# EAGLE design cpuboard_pic32mx_rev01 (EAGLE 6.4)
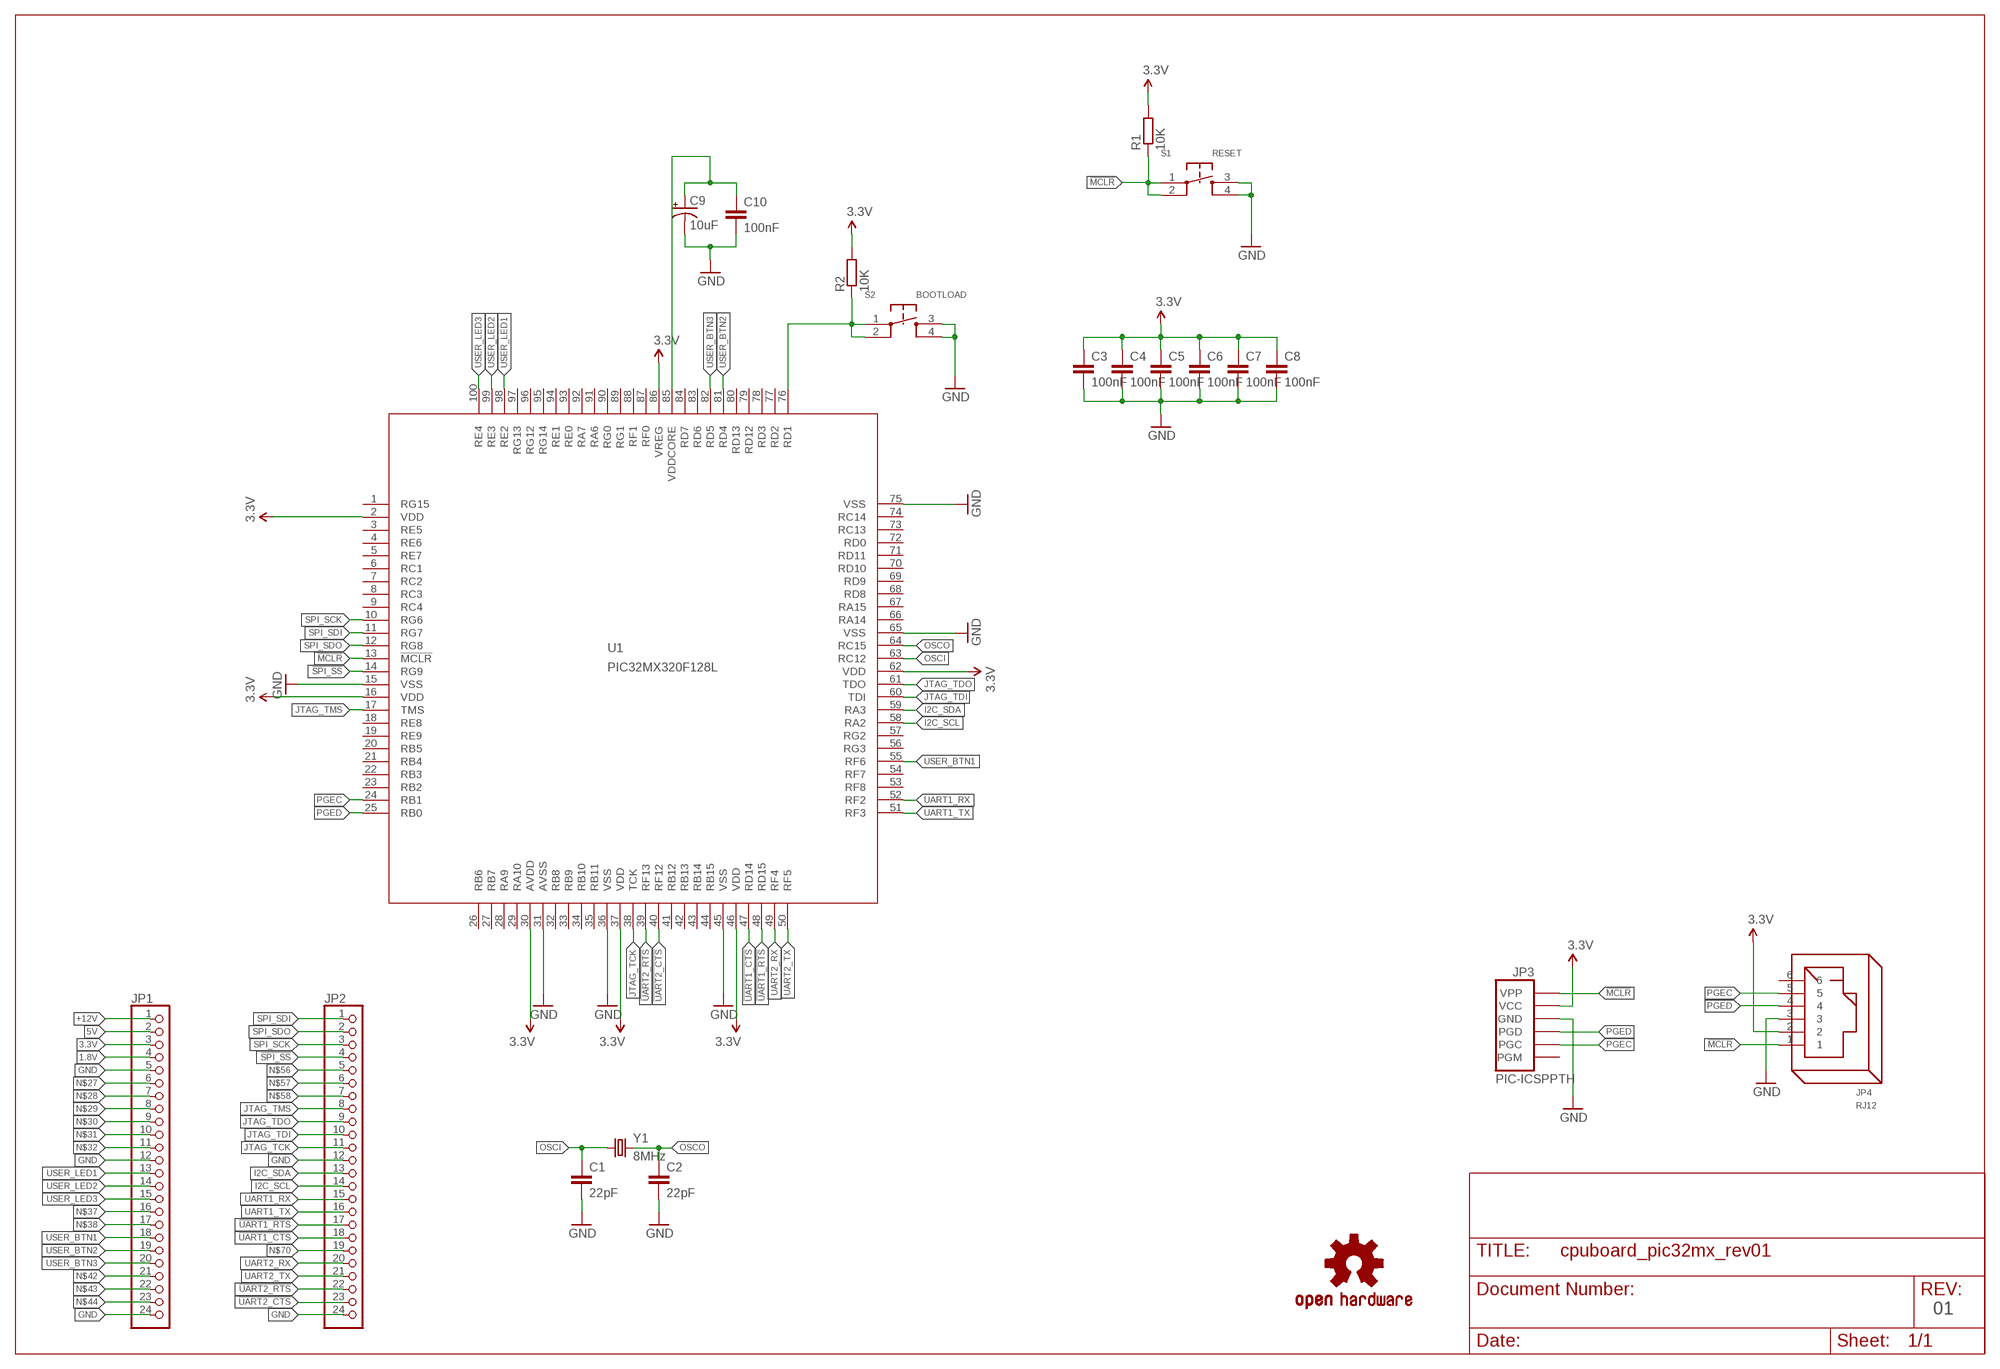
[diagram p0: schematic, sheet 1]

## Parts
C1  22pF  C-EUC0805K  [C0805K]
C2  22pF  C-EUC0805K  [C0805K]
C3  100nF  C-EUC0805K  [C0805K]
C4  100nF  C-EUC0805K  [C0805K]
C5  100nF  C-EUC0805K  [C0805K]
C6  100nF  C-EUC0805K  [C0805K]
C7  100nF  C-EUC0805K  [C0805K]
C8  100nF  C-EUC0805K  [C0805K]
C9  10uF  CAP_POLD  [PANASONIC_D]
C10  100nF  C-EUC0805K  [C0805K]
JP1  PINHD-1X24  [1X24]
JP2  PINHD-1X24  [1X24]
JP3  PIC-ICSPPTH  [MOLEX-1X6]
JP4  RJ12  [RJ12]
R1  10K  R-EU_R0805  [R0805]
R2  10K  R-EU_R0805  [R0805]
S1  RESET  SWITCH_TH  [SWITCH_TROUGHHOLE]
S2  BOOTLOAD  SWITCH_TH  [SWITCH_TROUGHHOLE]
U1  PIC32MX320F128L  [SQFP-S-12X12-100]
U$1  OSHW-LOGOS  [OSHW-LOGO-S]
Y1  8MHz  CRYSTALSMD  [HC49UP]

## Nets
1.8V: JP1.4
3.3V: C3.1 C4.1 C5.1 C6.1 C7.1 C8.1 JP1.3 JP3.5(VCC) JP4.2 R1.2 R2.2 U1.2(VDD) U1.16(VDD) U1.30(AVDD) U1.37(VDD) U1.46(VDD) U1.62(VDD) U1.86(VREG)
5V: JP1.2
!MCLR: JP3.6(VPP) JP4.1 R1.1 S1.1 S1.2 U1.13(!MCLR)
!SPI_SS: JP2.4 U1.14(RG9)
!UART1_CTS: JP2.18 U1.47(RD14)
!UART1_RTS: JP2.17 U1.48(RD15)
!UART2_CTS: JP2.23 U1.40(RF12)
!UART2_RTS: JP2.22 U1.39(RF13)
+12V: JP1.1
GND: C1.2 C2.2 C3.2 C4.2 C5.2 C6.2 C7.2 C8.2 C9.- C10.2 JP1.5 JP1.12 JP1.24 JP2.12 JP2.24 JP3.4(GND) JP4.3 S1.3 S1.4 S2.3 S2.4 U1.15(VSS) U1.31(AVSS) U1.36(VSS) U1.45(VSS) U1.65(VSS) U1.75(VSS)
I2C_SCL: JP2.14 U1.58(RA2)
I2C_SDA: JP2.13 U1.59(RA3)
JTAG_TCK: JP2.11 U1.38(TCK)
JTAG_TDI: JP2.10 U1.60(TDI)
JTAG_TDO: JP2.9 U1.61(TDO)
JTAG_TMS: JP2.8 U1.17(TMS)
N$2: C9.+ C10.1 U1.85(VDDCORE)
N$12: R2.1 S2.1 S2.2 U1.76(RD1)
N$27: JP1.6
N$28: JP1.7
N$29: JP1.8
N$30: JP1.9
N$31: JP1.10
N$32: JP1.11
N$37: JP1.16
N$38: JP1.17
N$42: JP1.21
N$43: JP1.22
N$44: JP1.23
N$56: JP2.5
N$57: JP2.6
N$58: JP2.7
N$70: JP2.19
OSCI: C1.1 U1.63(RC12) Y1.1
OSCO: C2.1 U1.64(RC15) Y1.2
PGEC: JP3.2(PGC) JP4.5 U1.24(RB1)
PGED: JP3.3(PGD) JP4.4 U1.25(RB0)
SPI_SCK: JP2.3 U1.10(RG6)
SPI_SDI: JP2.1 U1.11(RG7)
SPI_SDO: JP2.2 U1.12(RG8)
UART1_RX: JP2.15 U1.52(RF2)
UART1_TX: JP2.16 U1.51(RF3)
UART2_RX: JP2.20 U1.49(RF4)
UART2_TX: JP2.21 U1.50(RF5)
USER_BTN1: JP1.18 U1.55(RF6)
USER_BTN2: JP1.19 U1.81(RD4)
USER_BTN3: JP1.20 U1.82(RD5)
USER_LED1: JP1.13 U1.98(RE2)
USER_LED2: JP1.14 U1.99(RE3)
USER_LED3: JP1.15 U1.100(RE4)
Unconnected: JP3.1(PGM) JP4.6 U1.1(RG15) U1.3(RE5) U1.4(RE6) U1.5(RE7) U1.6(RC1) U1.7(RC2) U1.8(RC3) U1.9(RC4) U1.18(RE8) U1.19(RE9) U1.20(RB5) U1.21(RB4) U1.22(RB3) U1.23(RB2) U1.26(RB6) U1.27(RB7) U1.28(RA9) U1.29(RA10) U1.32(RB8) U1.33(RB9) U1.34(RB10) U1.35(RB11) U1.41(RB12) U1.42(RB13) U1.43(RB14) U1.44(RB15) U1.53(RF8) U1.54(RF7) U1.56(RG3) U1.57(RG2) U1.66(RA14) U1.67(RA15) U1.68(RD8) U1.69(RD9) U1.70(RD10) U1.71(RD11) U1.72(RD0) U1.73(RC13) U1.74(RC14) U1.77(RD2) U1.78(RD3) U1.79(RD12) U1.80(RD13) U1.83(RD6) U1.84(RD7) U1.87(RF0) U1.88(RF1) U1.89(RG1) U1.90(RG0) U1.91(RA6) U1.92(RA7) U1.93(RE0) U1.94(RE1) U1.95(RG14) U1.96(RG12) U1.97(RG13)

## Notes on the sheet
- 01

## Library data of the parts
C1-C8 C10 = rcl:C-EU: CAPACITOR, European symbol
C9 = SparkFun:CAP_POL: Capacitor Polarized These are standard SMD and PTH capacitors. Normally 10uF, 47uF, and 100uF in electrolytic and tantalum varieties. Always verify the external diameter of the through hole cap, it varies with capacity, voltage, and manufacturer. The EIA devices should be standard.
JP1 JP2 = pinhead:PINHD-1X24: PIN HEADER
JP3 = SparkFun-Connectors:PIC-ICSP: ISCP Programming connector for UAV, UBW Kit, etc.
JP4 = con-rj:RJ12: RJ12, RJ14 and RJ25 RJ12, RJ14 and RJ25 jacks side mounted http://www.tycoelectronics.com
R1 R2 = rcl:R-EU_: RESISTOR, European symbol
S1 S2 = funkfinger:SWITCH_TH
U1 = microchip:PIC32MX320F128L: PIC32MX320F128L edit this description Auto generated by make-symbol-device-package-bsdl.ulp Rev. 25 Source: PIC32MX320F128L.bsdl; MPN: PIC32MX320F128L-80I/PT; OC_FARNELL: 1523321; OC_NEWARK: 77M3149
U$1 = SparkFun-Aesthetics:OSHW-LOGO: Open Source Hardware Logo This logo indicates the piece of hardware it is found on incorporates a OSHW license and/or adheres to the definition of open source hardware found here: http://freedomdefined.org/OSHW
Y1 = SparkFun-FreqCtrl:CRYSTAL: Various standard crystals. Proven footprints. Spark Fun Electronics SKU : COM-00534

## Board
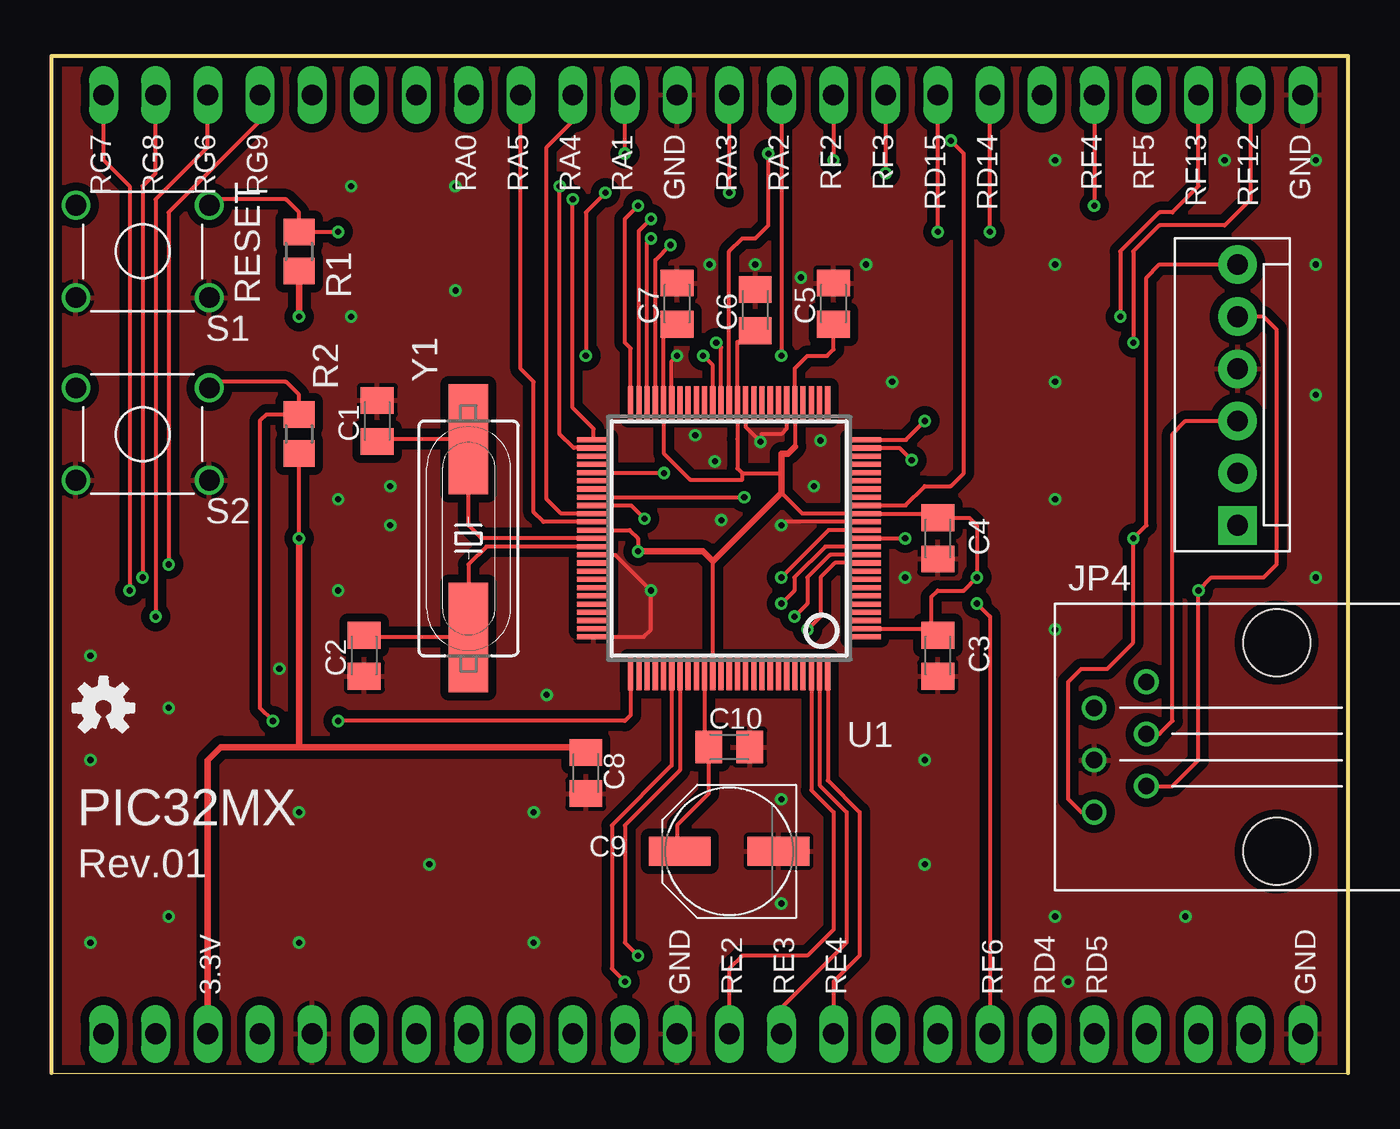
[diagram p1: board, top side]
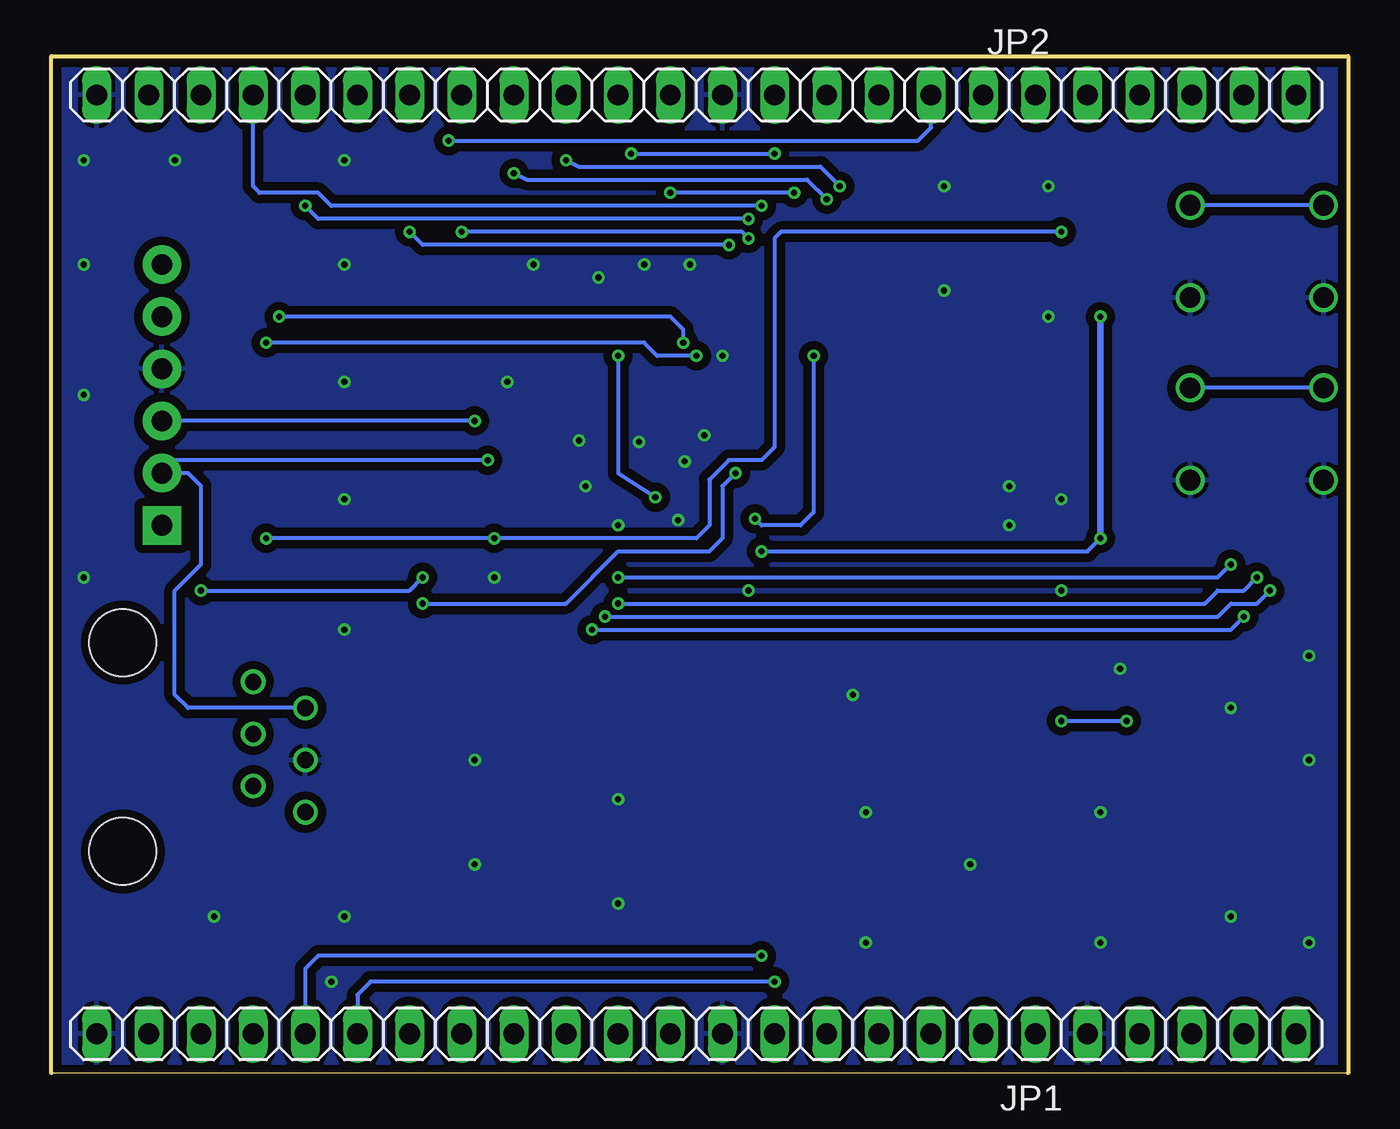
[diagram p2: board, bottom side, seen from below]

Size 63.17 x 49.52 mm. Coordinates in mm from the lower left corner, seen from the top.
Outline: 0,0 63.17,0 63.17,49.52 0,49.52 0,0
Copper layers (1*16): Top 0.035mm / dielectric 1.5mm / Bottom 0.035mm
Design rules "PCB-POOL Standard": minimum track width 0.15mm, minimum drill 0.3mm, track to track 0.15mm, track to pad 0.15mm, pad to pad 0.15mm, via to via 0.15mm, smd to smd 0.15mm, copper to edge 0.3mm, drill to drill 0.2mm, minimum pad ring 0.2mm, minimum via ring 0.15mm, stop-mask expansion 0.075mm, vias tented up to drill 0mil, thermal gap 0.2mm

### Footprints (pad centres in the part's own frame; a part is rotated, then mirrored left to right if it is on the bottom)
C0805K = smd 1.3 x 1.6: 1 -1,0; 2 1,0
PANASONIC_D = smd 3 x 1.4: + 2.4,0; - -2.4,0
1X24 = drill 1.016 long: 1 -29.21,0; 2 -26.67,0; 3 -24.13,0; 4 -21.59,0; 5 -19.05,0; 6 -16.51,0; 7 -13.97,0; 8 -11.43,0; 9 -8.89,0; 10 -6.35,0; 11 -3.81,0; 12 -1.27,0; 13 1.27,0; 14 3.81,0; 15 6.35,0; 16 8.89,0; 17 11.43,0; 18 13.97,0; 19 16.51,0; 20 19.05,0; 21 21.59,0; 22 24.13,0; 23 26.67,0; 24 29.21,0
MOLEX-1X6 = drill 1.016 pad 1.88 square: 1 0,0 | drill 1.016 pad 1.88: 2 2.54,0; 3 5.08,0; 4 7.62,0; 5 10.16,0; 6 12.7,0
RJ12 = drill 0.8: 1 -8.89,-3.175; 2 -6.35,-1.905; 3 -8.89,-0.635; 4 -6.35,0.635; 5 -8.89,1.905; 6 -6.35,3.175 | hole 3.25: 0,-5.08; 0,5.08
R0805 = smd 1.3 x 1.5: 1 -0.95,0; 2 0.95,0
SWITCH_TROUGHHOLE = drill 1: 1 -3.25,2.25; 2 3.25,2.25; 3 -3.25,-2.25; 4 3.25,-2.25
SQFP-S-12X12-100 = smd 0.25 x 1.6: 1 -4.8,-6.6; 2 -4.4,-6.6; 3 -4,-6.6; 4 -3.6,-6.6; 5 -3.2,-6.6; 6 -2.8,-6.6; 7 -2.4,-6.6; 8 -2,-6.6; 9 -1.6,-6.6; 10 -1.2,-6.6; 11 -0.8,-6.6; 12 -0.4,-6.6; 13 0,-6.6; 14 0.4,-6.6; 15 0.8,-6.6; 16 1.2,-6.6; 17 1.6,-6.6; 18 2,-6.6; 19 2.4,-6.6; 20 2.8,-6.6; 21 3.2,-6.6; 22 3.6,-6.6; 23 4,-6.6; 24 4.4,-6.6; 25 4.8,-6.6; 51 4.8,6.6; 52 4.4,6.6; 53 4,6.6; 54 3.6,6.6; 55 3.2,6.6; 56 2.8,6.6; 57 2.4,6.6; 58 2,6.6; 59 1.6,6.6; 60 1.2,6.6; 61 0.8,6.6; 62 0.4,6.6; 63 0,6.6; 64 -0.4,6.6; 65 -0.8,6.6; 66 -1.2,6.6; 67 -1.6,6.6; 68 -2,6.6; 69 -2.4,6.6; 70 -2.8,6.6; 71 -3.2,6.6; 72 -3.6,6.6; 73 -4,6.6; 74 -4.4,6.6; 75 -4.8,6.6 | smd 1.6 x 0.25: 26 6.6,-4.8; 27 6.6,-4.4; 28 6.6,-4; 29 6.6,-3.6; 30 6.6,-3.2; 31 6.6,-2.8; 32 6.6,-2.4; 33 6.6,-2; 34 6.6,-1.6; 35 6.6,-1.2; 36 6.6,-0.8; 37 6.6,-0.4; 38 6.6,0; 39 6.6,0.4; 40 6.6,0.8; 41 6.6,1.2; 42 6.6,1.6; 43 6.6,2; 44 6.6,2.4; 45 6.6,2.8; 46 6.6,3.2; 47 6.6,3.6; 48 6.6,4; 49 6.6,4.4; 50 6.6,4.8; 76 -6.6,4.8; 77 -6.6,4.4; 78 -6.6,4; 79 -6.6,3.6; 80 -6.6,3.2; 81 -6.6,2.8; 82 -6.6,2.4; 83 -6.6,2; 84 -6.6,1.6; 85 -6.6,1.2; 86 -6.6,0.8; 87 -6.6,0.4; 88 -6.6,0; 89 -6.6,-0.4; 90 -6.6,-0.8; 91 -6.6,-1.2; 92 -6.6,-1.6; 93 -6.6,-2; 94 -6.6,-2.4; 95 -6.6,-2.8; 96 -6.6,-3.2; 97 -6.6,-3.6; 98 -6.6,-4; 99 -6.6,-4.4; 100 -6.6,-4.8
HC49UP = smd 5.334 x 1.93: 1 -4.826,0; 2 4.826,0

### Placement (x,y rotation side)
C1  15.88,31.75 90 top
C2  15.24,20.32 270 top
C3  43.18,20.32 270 top
C4  43.18,26.04 270 top
C5  38.1,37.47 90 top
C6  34.29,37.15 90 top
C7  30.48,37.47 90 top
C8  26.04,14.61 270 top
C9  33.02,10.79 180 top
C10  33.02,15.88 0 top
JP1  31.75,1.91 180 bottom
JP2  31.75,47.62 180 bottom
JP3  57.79,26.67 90 top
JP4  59.69,15.88 0 top
R1  12.06,40.01 270 top
R2  12.06,31.11 270 top
S1  4.45,40.01 0 top
S2  4.45,31.11 0 top
U1  33.02,26.04 90 top
U$1  2.54,17.78 0 top
Y1  20.32,26.04 270 top

### Tracks (layer width: path | path; a pad name or v marks a point on that pad's centre or on a via)
3.3V  (via drill 0.3)
  Top 0.203: C5.1 38.1,35.24 37.78,34.93 36.83,34.93 36.22,34.32 U1.30 36.22,30.5 | U1.37 33.42,35.59 C6.1 | C7.1 29.82,35.8 U1.46 29.82,30.19 31.11,28.89 33.66,28.89 33.66,29.21 | U1.2 42.87,21.63 | 42.87,21.63 C3.1 | JP4.2 54.61,13.97 55.88,15.24 v55.88,23.49 56.52,24.13 59.05,24.13 59.69,24.76 59.69,36.2 59.05,36.83 JP3.5 | U1.37 33.42,29.44 33.66,29.21 | U1.62 28.18,26.43 28.57,26.04 v28.57,25.4 | v12.06,26.04 R2.2 | 35.56,28.26 36.58,27.23 U1.16 42.98,27.23 C4.1 44.72,27.04 45.09,26.67 v45.09,24.13 44.45,23.49 43.18,23.49 42.87,23.18 42.87,21.63 | U1.86 32.22,24.93 | 33.66,29.21 35.56,29.21 | U1.37 33.42,30.88
  Top 0.305: 36.22,30.5 35.88,30.16 35.56,30.16 35.56,29.21 35.56,28.26 32.55,25.25 32.22,24.93 31.75,25.4 v28.57,25.4 | 12.06,15.88 8.26,15.88 7.62,15.24 JP1.3 | 12.06,15.88 25.77,15.88 C8.1 | v12.06,26.04 12.06,15.88 | R1.2 v12.06,36.83
  Bottom 0.203: v28.57,25.4 12.7,25.4 v12.06,26.04 | v55.88,23.49 45.72,23.49 v45.09,24.13
  Bottom 0.305: v12.06,36.83 v12.06,26.04
!MCLR  (via drill 0.3)
  Top 0.203: U1.13 v41.59,26.04 | JP3.6 53.98,39.37 53.34,38.73 53.34,26.67 v52.71,26.04 52.71,20.95 51.44,19.68 50.17,19.68 49.53,19.05 49.53,13.34 50.17,12.7 JP4.1 | S1.2 7.98,42.55 11.43,42.55 12.06,41.91 R1.1 v13.97,40.96
  Bottom 0.203: v52.71,26.04 v41.59,26.04 31.75,26.04 31.11,26.67 31.11,28.89 30.16,29.84 28.57,29.84 27.94,30.48 27.94,40.64 27.62,40.96 v13.97,40.96 | S1.1 S1.2
!SPI_SS  (via drill 0.3)
  Top 0.203: v5.71,24.76 5.71,41.91 10.16,46.36 JP2.4 | U1.14 37.87,26.43 v35.56,24.13
  Bottom 0.203: v35.56,24.13 6.35,24.13 v5.71,24.76
!UART1_CTS  (via drill 0.3)
  Top 0.203: U1.47 29.42,39.58 v30.16,40.32 | v45.72,40.96 JP2.18
  Bottom 0.203: v30.16,40.32 45.09,40.32 v45.72,40.96
!UART1_RTS  (via drill 0.3)
  Top 0.203: U1.48 29.02,40.45 v29.21,40.64 | v43.18,40.96 JP2.17
  Bottom 0.203: v29.21,40.64 29.53,40.96 v43.18,40.96
!UART2_CTS  (via drill 0.3)
  Top 0.203: v52.71,35.56 52.71,40.01 53.98,41.27 57.15,41.27 58.42,42.55 JP2.23 | U1.40 32.22,34.46 v31.75,34.93
  Bottom 0.203: v31.75,34.93 33.66,34.93 34.29,35.56 v52.71,35.56
!UART2_RTS  (via drill 0.3)
  Top 0.203: v52.07,36.83 52.07,40.01 53.98,41.91 54.61,41.91 55.88,43.18 JP2.22 | U1.39 32.62,35.33 v32.38,35.56
  Bottom 0.203: v32.38,35.56 32.38,36.2 33.02,36.83 v52.07,36.83
GND  (via drill 0.3)
  Top 0.203: U1.65 27.47,25.23 v29.21,23.49 29.21,21.59 28.86,21.23 U1.75 | U1.45 30.22,34.66 v30.48,34.93 | U1.15 35.73,26.83 v35.56,26.67 | U1.36 33.82,31.46 v34.54,30.73 34.61,31.11 35.56,31.11 35.82,31.37 U1.31
  other vias: 48.9,27.94 48.9,33.66 48.9,39.37 48.9,44.45 57.15,44.45 61.6,44.45 61.6,33.02 61.6,39.37 61.6,24.13 55.25,7.62 48.9,7.62 48.9,21.59 42.55,15.24 42.55,10.16 23.5,6.35 12.06,6.35 12.06,12.7 23.5,12.7 18.41,10.16 1.91,20.32 1.91,15.24 1.91,6.35 5.71,17.78 5.71,7.62 16.51,28.57 14.61,36.83 19.68,38.1 14.61,43.18 19.68,43.18 32.64,26.92 13.97,23.49 16.51,26.67 13.97,27.94 24.13,18.41 11.11,19.68 37.15,28.57 40.96,33.66 39.69,39.37 36.51,38.73 32.07,39.37 34.29,39.37 41.59,24.13 35.56,13.34 35.56,8.26 31.37,31.05 32.32,29.78 37.47,30.8 49.53,4.45
  pour Bottom (isolate 0.406): 0,49.53 63.5,49.53 63.5,0 0,0
  pour Top (isolate 0.406): 0,49.53 63.5,49.53 63.5,0 0,0
I2C_SCL  (via drill 0.3)
  Top 0.203: JP2.14 v35.56,34.93 | U1.58 v33.75,28.04
  Bottom 0.203: v35.56,34.93 35.56,29.21 v33.75,28.04
I2C_SDA  (via drill 0.3)
  Top 0.203: JP2.13 v33.02,42.86 | v26.99,42.86 26.04,41.91 v26.04,34.93 | U1.59 28.25,27.63 v28.89,26.99
  Bottom 0.203: v26.99,42.86 v33.02,42.86 | v26.04,34.93 26.04,27.3 26.67,26.67 28.57,26.67 v28.89,26.99
JTAG_TCK  (via drill 0.3)
  Top 0.203: v27.94,44.77 JP2.11 | U1.38 33.02,40.01 33.66,40.64 34.29,40.64 34.93,41.27 v34.93,44.77
  Bottom 0.203: v34.93,44.77 v27.94,44.77
JTAG_TDI
  Top 0.203: U1.60 24.84,27.23 24.13,27.94 24.13,45.09 25.4,46.36 JP2.10
JTAG_TDO
  Top 0.203: U1.61 23.96,26.83 23.5,27.3 23.5,33.66 22.86,34.29 JP2.9
JTAG_TMS  (via drill 0.3)
  Top 0.203: U1.17 41.61,27.63 42.55,28.57 43.82,28.57 44.45,29.21 44.45,44.77 v43.82,45.4
  Bottom 0.203: v43.82,45.4 20.95,45.4 20.32,46.04 JP2.8
N$2
  Top 0.203: U1.85 31.82,16.07 C10.1 32.02,13.61 30.48,12.06 30.48,10.94 C9.+
N$12  (via drill 0.3)
  Top 0.203: S2.2 7.98,33.66 11.43,33.66 12.06,33.02 R2.1 10.47,32.07 10.16,31.75 10.16,17.78 v10.79,17.14 | U1.76 28.22,17.42 27.94,17.14 v13.97,17.14
  Bottom 0.203: S2.1 S2.2 | v13.97,17.14 v10.79,17.14
OSCI
  Top 0.203: U1.63 20.95,26.04 20.32,26.67 Y1.1 15.99,30.86 C1.1
OSCO
  Top 0.203: U1.64 21.19,25.63 20.32,24.76 Y1.2 15.35,21.21 C2.1
PGEC  (via drill 0.3)
  Top 0.203: U1.24 41.32,30.43 v41.91,29.84
  Bottom 0.203: JP4.5 56.52,17.78 57.15,18.41 57.15,23.49 55.88,24.76 55.88,28.57 56.52,29.21 JP3.2 57.15,29.84 v41.91,29.84
PGED  (via drill 0.3)
  Top 0.203: JP4.4 53.98,16.51 54.61,17.14 54.61,31.11 55.25,31.75 JP3.3 | U1.25 41.63,30.83 v42.55,31.75
  Bottom 0.203: v42.55,31.75 JP3.3
SPI_SCK  (via drill 0.3)
  Top 0.203: v5.08,22.22 5.08,42.55 7.62,45.09 JP2.3 | U1.10 38.17,24.83 37.47,24.13 37.47,22.22 v36.83,21.59
  Bottom 0.203: v36.83,21.59 5.71,21.59 v5.08,22.22
SPI_SDI  (via drill 0.3)
  Top 0.203: v3.81,23.49 3.81,43.18 2.54,44.45 JP2.1 | U1.11 37.94,25.23 36.83,24.13 36.83,22.86 v36.2,22.22
  Bottom 0.203: v36.2,22.22 6.35,22.22 5.71,22.86 4.45,22.86 v3.81,23.49
SPI_SDO  (via drill 0.3)
  Top 0.203: v4.45,24.13 4.45,43.18 5.08,43.82 JP2.2 | U1.12 37.7,25.63 36.2,24.13 36.2,23.49 v35.56,22.86
  Bottom 0.203: v35.56,22.86 6.98,22.86 6.35,23.49 5.08,23.49 v4.45,24.13
UART1_RX  (via drill 0.3)
  Top 0.203: U1.52 25.45,30.43 24.77,31.11 v24.77,43.18 | JP2.15 v38.1,44.45
  Bottom 0.203: v38.1,44.45 37.47,44.13 25.72,44.13 v24.77,43.18
UART1_TX  (via drill 0.3)
  Top 0.203: JP2.16 v40.64,43.82 | U1.51 26.42,31.36 25.4,32.39 v25.4,42.55
  Bottom 0.203: v40.64,43.82 40.01,43.5 26.35,43.5 v25.4,42.55
UART2_RX  (via drill 0.3)
  Top 0.203: U1.49 28.62,41 v29.21,41.59 | JP2.20 v50.8,42.23
  Bottom 0.203: v29.21,41.59 50.17,41.59 v50.8,42.23
UART2_TX  (via drill 0.3)
  Top 0.203: U1.50 28.22,35.28 27.94,35.56 27.94,41.59 v28.57,42.23
  Bottom 0.203: v28.57,42.23 49.53,42.23 50.17,42.86 53.02,42.86 53.34,43.18 JP2.21
USER_BTN1  (via drill 0.3)
  Top 0.203: v45.09,22.86 45.72,22.22 JP1.18 | U1.55 29.82,29.23 v29.84,29.21
  Bottom 0.203: v45.09,22.86 38.1,22.86 35.56,25.4 31.11,25.4 30.48,26.04 30.48,28.57 v29.84,29.21
USER_BTN2  (via drill 0.3)
  Top 0.203: U1.81 30.22,14.98 27.3,12.06 27.3,5.08 v27.94,4.45
  Bottom 0.203: v27.94,4.45 47.62,4.45 48.26,3.81 JP1.19
USER_BTN3  (via drill 0.3)
  Top 0.203: U1.82 30.62,14.75 27.94,12.06 27.94,6.35 v28.57,5.71
  Bottom 0.203: v28.57,5.71 50.17,5.71 50.8,5.08 JP1.20
USER_LED1
  Top 0.203: U1.98 37.02,13.78 38.1,12.7 38.1,6.99 36.83,5.71 33.66,5.71 33.02,5.08 JP1.13
USER_LED2
  Top 0.203: U1.99 37.42,14.02 38.74,12.7 38.74,6.35 35.56,3.17 JP1.14
USER_LED3
  Top 0.203: U1.100 37.82,14.25 39.37,12.7 39.37,5.71 38.1,4.45 JP1.15

### Text on the board
tPlace: RG7 | RG8 | RG6 | RG9 | RA0 | RA5 | RA4 | RA1 | GND | RA3 | RA2 | RF2 | RF3 | RD15 | RD14 | RF4 | RF5 | RF13 | RF12 | GND | RESET | PIC32MX | Rev.01 | 3.3V | GND | RE2 | RE3 | RE4 | RF6 | RD4 | RD5 | GND